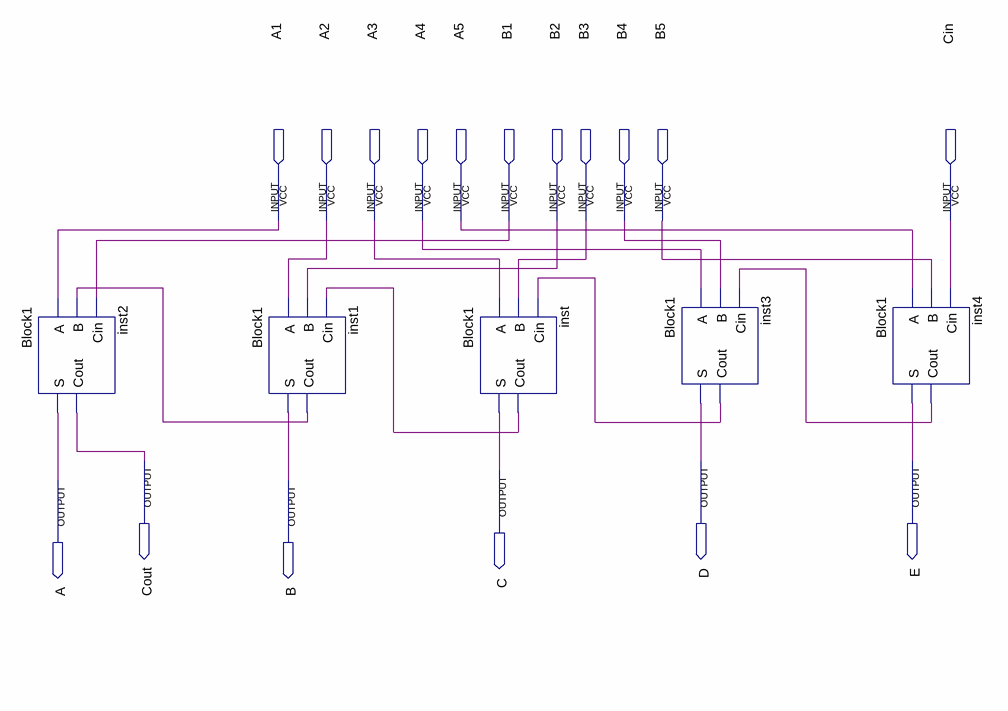
[diagram p0: schematic sheet]
// Quartus schematic SOMADOR_5bits.bdf as structural Verilog: 5 symbols, 17 pins
module SOMADOR_5bits (
  input  A1,
  input  A2,
  input  A3,
  input  A4,
  input  A5,
  input  B1,
  input  B2,
  input  B3,
  input  B4,
  input  B5,
  input  Cin,
  output Cout,
  output D,
  output E,
  output C,
  output A,
  output B
);

  wire inst1_cout, inst3_cout, inst4_cout, inst_cout;

  Block1 inst2 (.A(A1), .B(inst1_cout), .Cin(B1), .S(A), .Cout(Cout));
  Block1 inst1 (.A(A2), .B(B2), .Cin(inst_cout), .S(B), .Cout(inst1_cout));
  Block1 inst (.A(A3), .B(B3), .Cin(inst3_cout), .S(C), .Cout(inst_cout));
  Block1 inst3 (.A(A4), .B(B4), .Cin(inst4_cout), .S(D), .Cout(inst3_cout));
  Block1 inst4 (.A(A5), .B(B5), .Cin(Cin), .S(E), .Cout(inst4_cout));
endmodule
